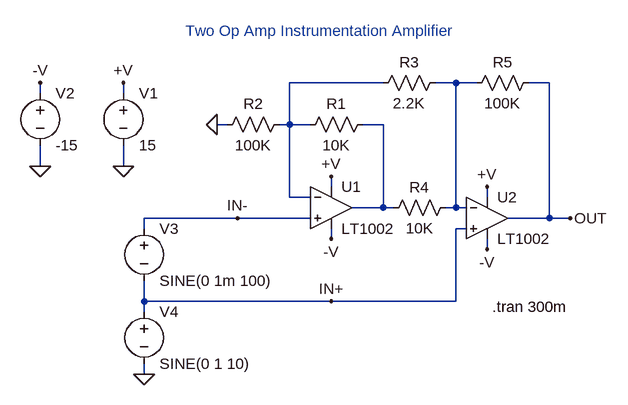
[diagram p0: schematic 1002.asc]
1002.asc, the LTspice schematic file:
Version 4
SHEET 1 896 680
WIRE 272 48 128 48
WIRE 384 48 352 48
WIRE 416 48 384 48
WIRE 528 48 496 48
WIRE -256 64 -256 48
WIRE -128 64 -128 48
WIRE 32 112 16 112
WIRE 128 112 128 48
WIRE 128 112 112 112
WIRE 160 112 128 112
WIRE 272 112 240 112
WIRE -256 176 -256 144
WIRE -128 176 -128 144
WIRE 192 208 192 192
WIRE 128 224 128 112
WIRE 160 224 128 224
WIRE 432 224 432 208
WIRE 272 240 272 112
WIRE 272 240 224 240
WIRE 288 240 272 240
WIRE 384 240 384 48
WIRE 384 240 368 240
WIRE 400 240 384 240
WIRE 48 256 -96 256
WIRE 160 256 48 256
WIRE 528 256 528 48
WIRE 528 256 464 256
WIRE 560 256 528 256
WIRE -96 272 -96 256
WIRE 400 272 384 272
WIRE 192 288 192 272
WIRE 432 304 432 288
WIRE -96 384 -96 352
WIRE 192 384 -96 384
WIRE 384 384 384 272
WIRE 384 384 192 384
WIRE -96 400 -96 384
WIRE -96 496 -96 480
FLAG -128 176 0
FLAG 192 192 +V
FLAG -128 48 +V
FLAG 192 288 -V
FLAG -256 176 0
FLAG -256 48 -V
FLAG 16 112 0
FLAG -96 496 0
FLAG 432 208 +V
FLAG 432 304 -V
FLAG 48 256 IN-
FLAG 192 384 IN+
FLAG 560 256 OUT
SYMBOL voltage -128 48 R0
SYMATTR InstName V1
SYMATTR Value 15
SYMBOL voltage -256 48 R0
SYMATTR InstName V2
SYMATTR Value -15
SYMBOL res 256 96 R90
WINDOW 0 0 56 VBottom 0
WINDOW 3 32 56 VTop 0
SYMATTR InstName R1
SYMATTR Value 10K
SYMBOL res 128 96 R90
WINDOW 0 0 56 VBottom 0
WINDOW 3 32 56 VTop 0
SYMATTR InstName R2
SYMATTR Value 100K
SYMBOL voltage -96 256 R0
SYMATTR InstName V3
SYMATTR Value SINE(0 1m 100)
SYMBOL opamps\\LT1002 192 176 R0
SYMATTR InstName U1
SYMBOL opamps\\LT1002 432 192 R0
SYMATTR InstName U2
SYMBOL res 368 32 R90
WINDOW 0 0 56 VBottom 0
WINDOW 3 32 56 VTop 0
SYMATTR InstName R3
SYMATTR Value 2.2K
SYMBOL res 384 224 R90
WINDOW 0 0 56 VBottom 0
WINDOW 3 32 56 VTop 0
SYMATTR InstName R4
SYMATTR Value 10K
SYMBOL res 512 32 R90
WINDOW 0 0 56 VBottom 0
WINDOW 3 32 56 VTop 0
SYMATTR InstName R5
SYMATTR Value 100K
SYMBOL voltage -96 384 R0
SYMATTR InstName V4
SYMATTR Value SINE(0 1 10)
TEXT 440 392 Left 0 !.tran 300m
TEXT -32 -32 Left 0 ;Two Op Amp Instrumentation Amplifier

The netlist it stands for:
* 1002.asc
V1 +V 0 15
V2 -V 0 -15
R1 N003 N001 10K
R2 N001 0 100K
V3 IN- IN+ SINE(0 1m 100)
XU1 IN- N001 +V -V N003 LT1002  ; pins In+ In- V+ V- OUT
XU2 IN+ N002 +V -V OUT LT1002  ; pins In+ In- V+ V- OUT
R3 N002 N001 2.2K
R4 N002 N003 10K
R5 OUT N002 100K
V4 IN+ 0 SINE(0 1 10)
.tran 300m
* Two Op Amp Instrumentation Amplifier
.backanno
.end